# Altium schematic sheet Sensor.SchDoc: NH Speaker Sensor 16CH 2.3_C
size A2; Revision: 2.3; SheetNumber: 4; SheetTotal: 6
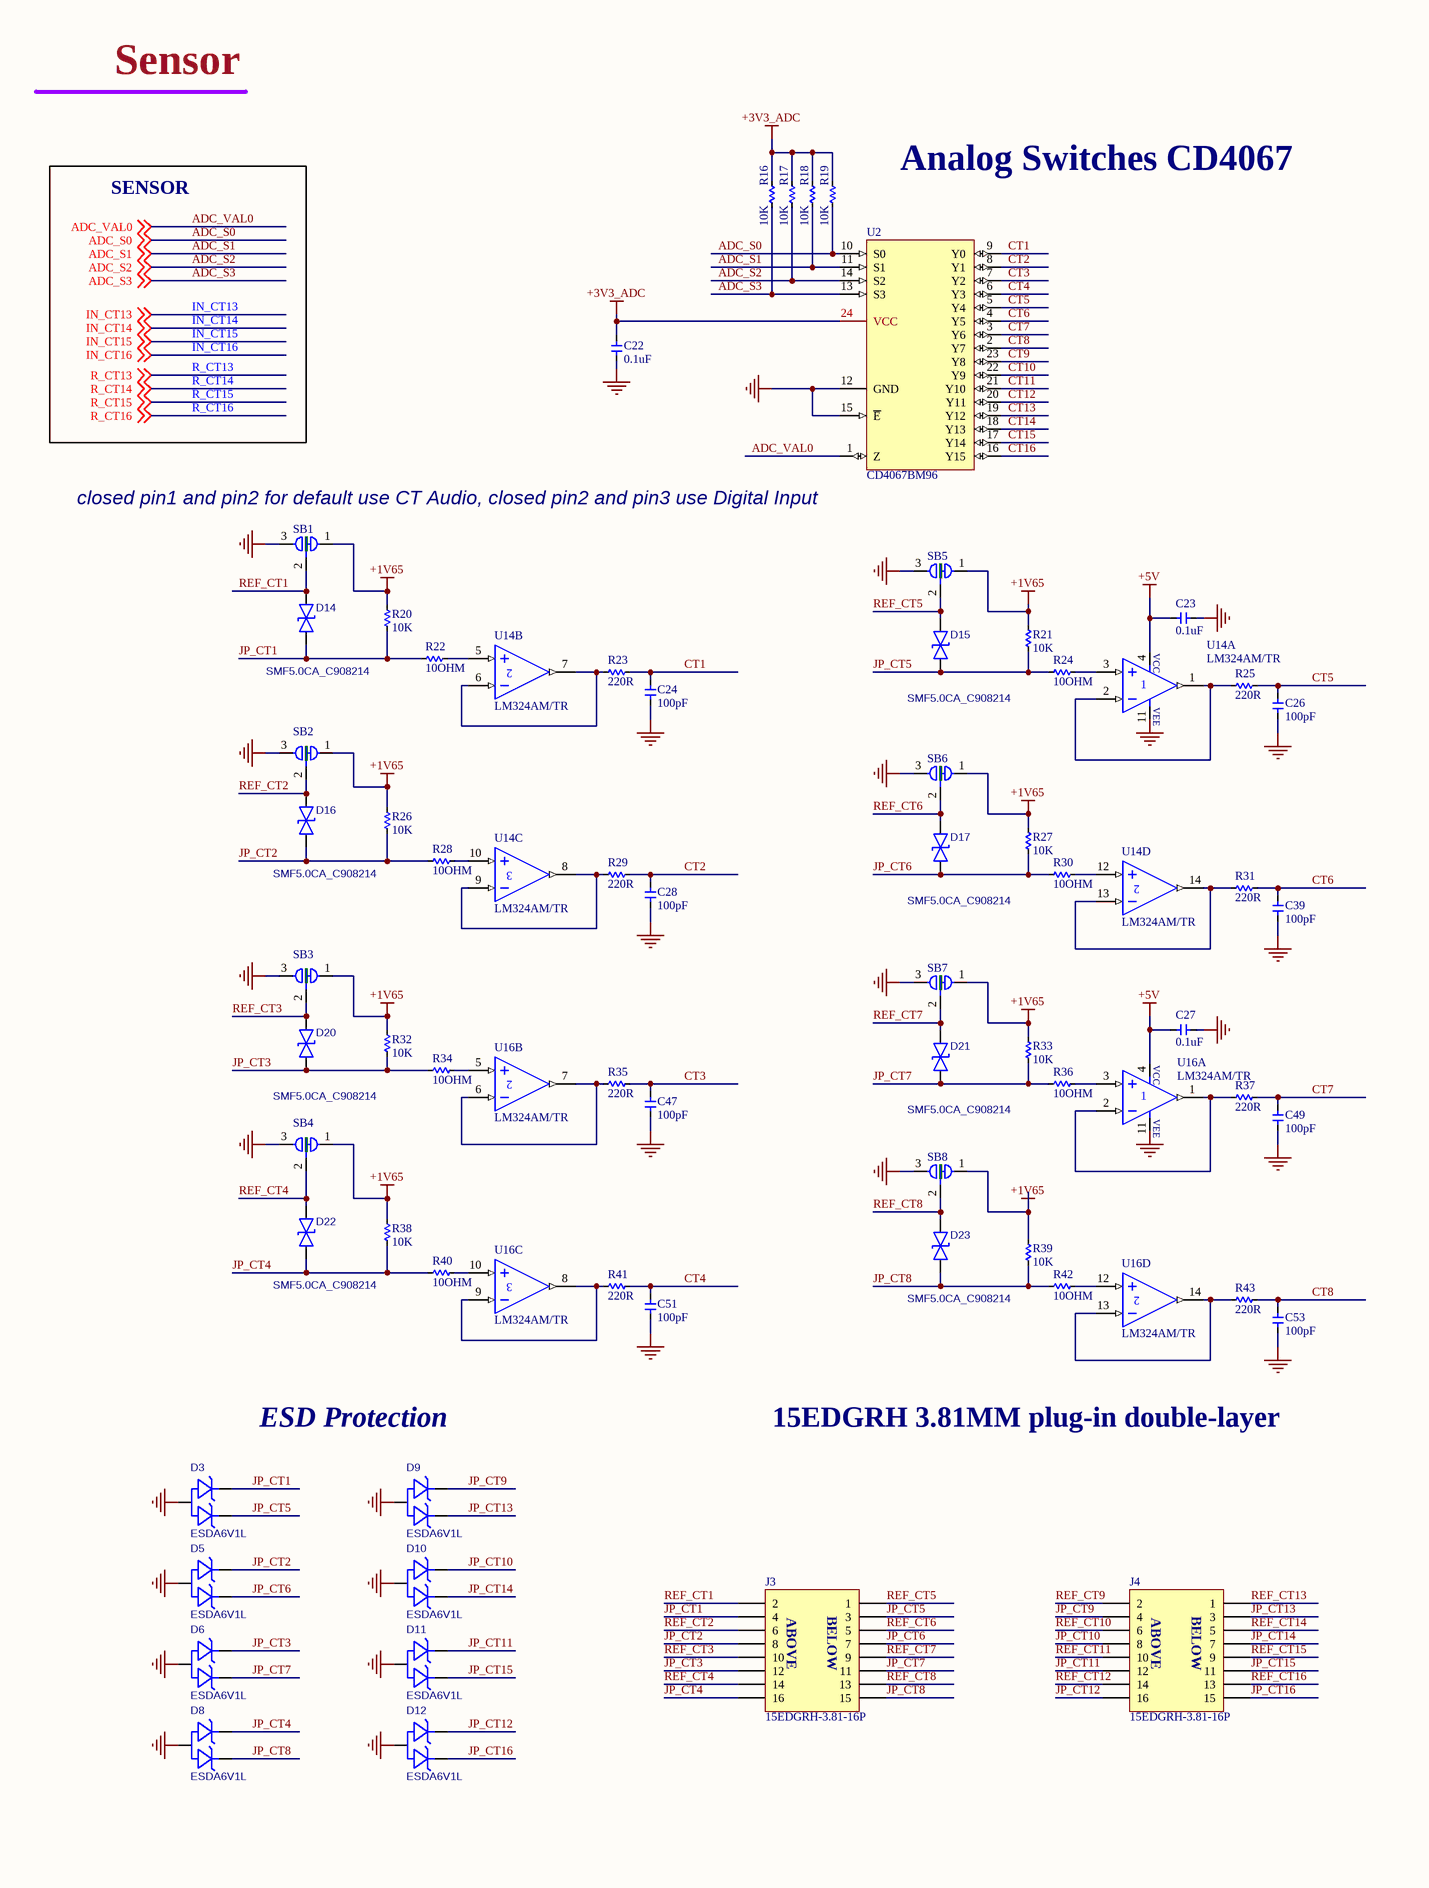
[diagram p0: Sensor.SchDoc, left]
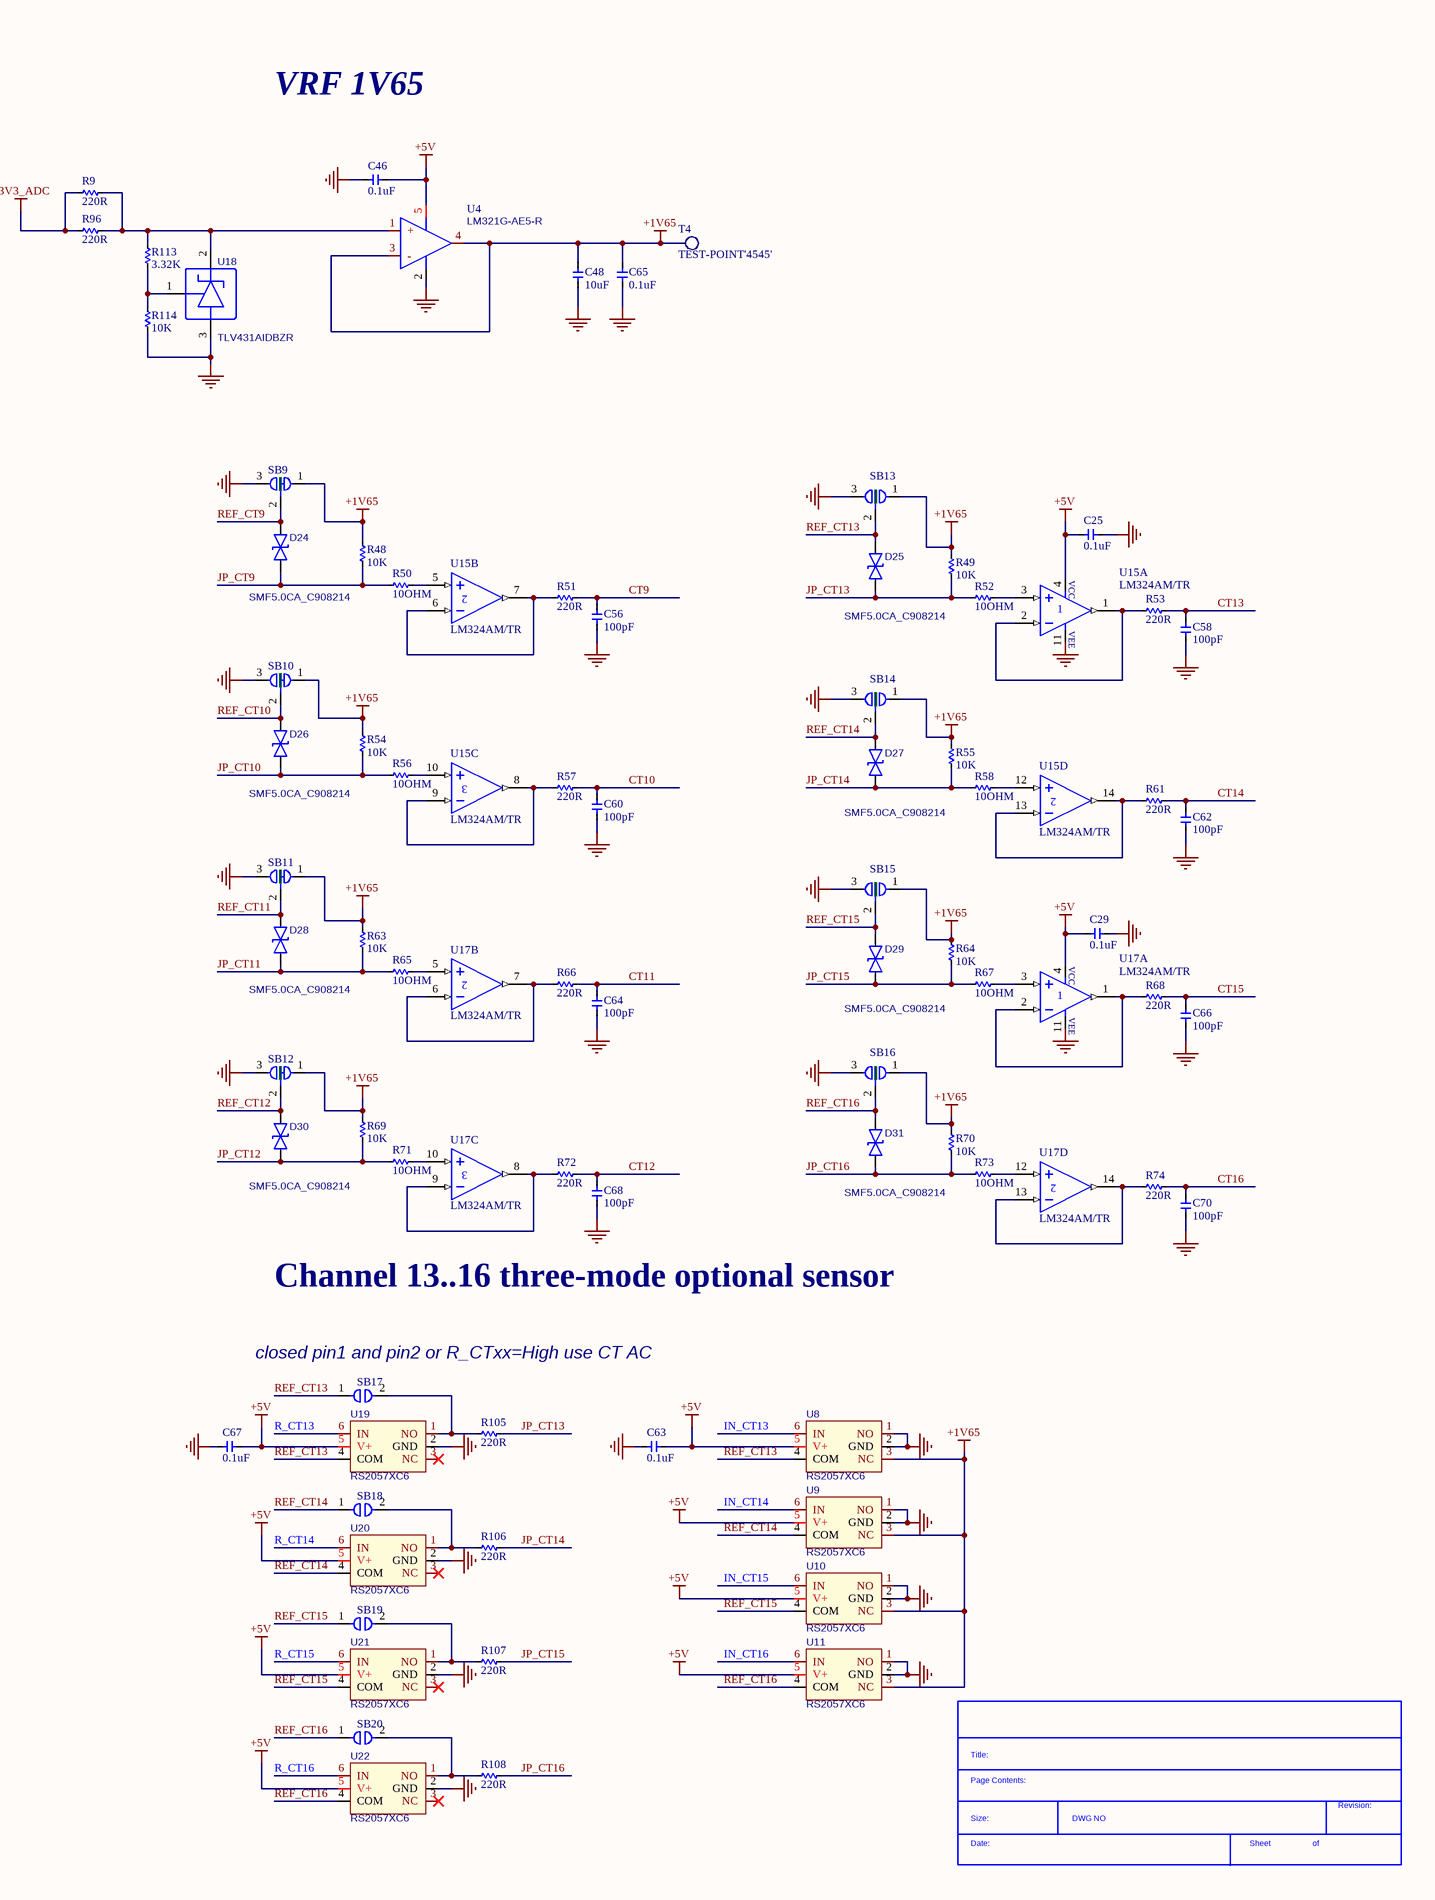
[diagram p1: Sensor.SchDoc, right]

## Parts
*?  SDTitleBlock  (value not drawn)  (graphical)
C22  0.1uF  [C_0603]
C23  0.1uF  [C_0603]
C24  100pF  [C_0603]
C25  0.1uF  [C_0603]
C26  100pF  [C_0603]
C27  0.1uF  [C_0603]
C28  100pF  [C_0603]
C29  0.1uF  [C_0603]
C39  100pF  [C_0603]
C46  0.1uF  [C_0603]
C47  100pF  [C_0603]
C48  10uF  [C_0603]
C49  100pF  [C_0603]
C51  100pF  [C_0603]
C53  100pF  [C_0603]
C56  100pF  [C_0603]
C58  100pF  [C_0603]
C60  100pF  [C_0603]
C62  100pF  [C_0603]
C63  0.1uF  [C_0603]
C64  100pF  [C_0603]
C65  0.1uF  [C_0603]
C66  100pF  [C_0603]
C67  0.1uF  [C_0603]
C68  100pF  [C_0603]
C70  100pF  [C_0603]
D3  ESDA6V1L  [SOT-23-3_L2.9-W1.3-P1.90-LS2.4-BR]
D5  ESDA6V1L  [SOT-23-3_L2.9-W1.3-P1.90-LS2.4-BR]
D6  ESDA6V1L  [SOT-23-3_L2.9-W1.3-P1.90-LS2.4-BR]
D8  ESDA6V1L  [SOT-23-3_L2.9-W1.3-P1.90-LS2.4-BR]
D9  ESDA6V1L  [SOT-23-3_L2.9-W1.3-P1.90-LS2.4-BR]
D10  ESDA6V1L  [SOT-23-3_L2.9-W1.3-P1.90-LS2.4-BR]
D11  ESDA6V1L  [SOT-23-3_L2.9-W1.3-P1.90-LS2.4-BR]
D12  ESDA6V1L  [SOT-23-3_L2.9-W1.3-P1.90-LS2.4-BR]
D14  SMF5.0CA_C908214  [SOD-123_L2.8-W1.8-LS3.7-BI]
D15  SMF5.0CA_C908214  [SOD-123_L2.8-W1.8-LS3.7-BI]
D16  SMF5.0CA_C908214  [SOD-123_L2.8-W1.8-LS3.7-BI]
D17  SMF5.0CA_C908214  [SOD-123_L2.8-W1.8-LS3.7-BI]
D20  SMF5.0CA_C908214  [SOD-123_L2.8-W1.8-LS3.7-BI]
D21  SMF5.0CA_C908214  [SOD-123_L2.8-W1.8-LS3.7-BI]
D22  SMF5.0CA_C908214  [SOD-123_L2.8-W1.8-LS3.7-BI]
D23  SMF5.0CA_C908214  [SOD-123_L2.8-W1.8-LS3.7-BI]
D24  SMF5.0CA_C908214  [SOD-123_L2.8-W1.8-LS3.7-BI]
D25  SMF5.0CA_C908214  [SOD-123_L2.8-W1.8-LS3.7-BI]
D26  SMF5.0CA_C908214  [SOD-123_L2.8-W1.8-LS3.7-BI]
D27  SMF5.0CA_C908214  [SOD-123_L2.8-W1.8-LS3.7-BI]
D28  SMF5.0CA_C908214  [SOD-123_L2.8-W1.8-LS3.7-BI]
D29  SMF5.0CA_C908214  [SOD-123_L2.8-W1.8-LS3.7-BI]
D30  SMF5.0CA_C908214  [SOD-123_L2.8-W1.8-LS3.7-BI]
D31  SMF5.0CA_C908214  [SOD-123_L2.8-W1.8-LS3.7-BI]
J3  15EDGRH-3.81-16P  [Header 3.81 8 pin dual row]
J4  15EDGRH-3.81-16P  [Header 3.81 8 pin dual row]
R9  220R  [R_0603]
R16  10K  [R_0603]
R17  10K  [R_0603]
R18  10K  [R_0603]
R19  10K  [R_0603]
R20  10K  [R_0603]
R21  10K  [R_0603]
R22  10OHM  [R_0603]
R23  220R  [R_0603]
R24  10OHM  [R_0603]
R25  220R  [R_0603]
R26  10K  [R_0603]
R27  10K  [R_0603]
R28  10OHM  [R_0603]
R29  220R  [R_0603]
R30  10OHM  [R_0603]
R31  220R  [R_0603]
R32  10K  [R_0603]
R33  10K  [R_0603]
R34  10OHM  [R_0603]
R35  220R  [R_0603]
R36  10OHM  [R_0603]
R37  220R  [R_0603]
R38  10K  [R_0603]
R39  10K  [R_0603]
R40  10OHM  [R_0603]
R41  220R  [R_0603]
R42  10OHM  [R_0603]
R43  220R  [R_0603]
R48  10K  [R_0603]
R49  10K  [R_0603]
R50  10OHM  [R_0603]
R51  220R  [R_0603]
R52  10OHM  [R_0603]
R53  220R  [R_0603]
R54  10K  [R_0603]
R55  10K  [R_0603]
R56  10OHM  [R_0603]
R57  220R  [R_0603]
R58  10OHM  [R_0603]
R61  220R  [R_0603]
R63  10K  [R_0603]
R64  10K  [R_0603]
R65  10OHM  [R_0603]
R66  220R  [R_0603]
R67  10OHM  [R_0603]
R68  220R  [R_0603]
R69  10K  [R_0603]
R70  10K  [R_0603]
R71  10OHM  [R_0603]
R72  220R  [R_0603]
R73  10OHM  [R_0603]
R74  220R  [R_0603]
R96  220R  [R_0603]
R105  220R  [R_0603]
R106  220R  [R_0603]
R107  220R  [R_0603]
R108  220R  [R_0603]
R113  3.32K  [R_0603]
R114  10K  [R_0603]
SB1  SOLDERJUMPER_2WAY  [SOLDERJUMPER_2WAY]  (value not drawn)  (no BOM)
SB2  SOLDERJUMPER_2WAY  [SOLDERJUMPER_2WAY]  (value not drawn)  (no BOM)
SB3  SOLDERJUMPER_2WAY  [SOLDERJUMPER_2WAY]  (value not drawn)  (no BOM)
SB4  SOLDERJUMPER_2WAY  [SOLDERJUMPER_2WAY]  (value not drawn)  (no BOM)
SB5  SOLDERJUMPER_2WAY  [SOLDERJUMPER_2WAY]  (value not drawn)  (no BOM)
SB6  SOLDERJUMPER_2WAY  [SOLDERJUMPER_2WAY]  (value not drawn)  (no BOM)
SB7  SOLDERJUMPER_2WAY  [SOLDERJUMPER_2WAY]  (value not drawn)  (no BOM)
SB8  SOLDERJUMPER_2WAY  [SOLDERJUMPER_2WAY]  (value not drawn)  (no BOM)
SB9  SOLDERJUMPER_2WAY  [SOLDERJUMPER_2WAY]  (value not drawn)  (no BOM)
SB10  SOLDERJUMPER_2WAY  [SOLDERJUMPER_2WAY]  (value not drawn)  (no BOM)
SB11  SOLDERJUMPER_2WAY  [SOLDERJUMPER_2WAY]  (value not drawn)  (no BOM)
SB12  SOLDERJUMPER_2WAY  [SOLDERJUMPER_2WAY]  (value not drawn)  (no BOM)
SB13  SOLDERJUMPER_2WAY_No JP  [SOLDERJUMPER_2WAY - No JP]  (value not drawn)  (no BOM)
SB14  SOLDERJUMPER_2WAY_No JP  [SOLDERJUMPER_2WAY - No JP]  (value not drawn)  (no BOM)
SB15  SOLDERJUMPER_2WAY_No JP  [SOLDERJUMPER_2WAY - No JP]  (value not drawn)  (no BOM)
SB16  SOLDERJUMPER_2WAY_No JP  [SOLDERJUMPER_2WAY - No JP]  (value not drawn)  (no BOM)
SB17  SOLDERJUMPER_1WAY  [SOLDERJUMPER_1WAY]  (value not drawn)  (no BOM)
SB18  SOLDERJUMPER_1WAY  [SOLDERJUMPER_1WAY]  (value not drawn)  (no BOM)
SB19  SOLDERJUMPER_1WAY  [SOLDERJUMPER_1WAY]  (value not drawn)  (no BOM)
SB20  SOLDERJUMPER_1WAY  [SOLDERJUMPER_1WAY]  (value not drawn)  (no BOM)
T4  TEST-POINT'4545'  [TP-D45MIL]  (no BOM)
U2  CD4067BM96  [SOIC-24_L15.4-W7.5-P1.27-LS10.3-BL]
U4  LM321G-AE5-R  [SOT-23-5_L3.0-W1.7-P0.95-LS2.8-BR]
U8  RS2057XC6  [SC-70-6_L2.2-W1.3-P0.65-LS2.2-BL]
U9  RS2057XC6  [SC-70-6_L2.2-W1.3-P0.65-LS2.2-BL]
U10  RS2057XC6  [SC-70-6_L2.2-W1.3-P0.65-LS2.2-BL]
U11  RS2057XC6  [SC-70-6_L2.2-W1.3-P0.65-LS2.2-BL]
U14  LM324AM/TR  [SOIC-14_3.9x8.7x1.27P]  (parts A,B,C,D of 4)
U15  LM324AM/TR  [SOIC-14_3.9x8.7x1.27P]  (parts A,B,C,D of 4)
U16  LM324AM/TR  [SOIC-14_3.9x8.7x1.27P]  (parts A,B,C,D of 4)
U17  LM324AM/TR  [SOIC-14_3.9x8.7x1.27P]  (parts A,B,C,D of 4)
U18  TLV431AIDBZR  [SOT-23-3_L2.9-W1.3-P1.90-LS2.4-BR]
U19  RS2057XC6  [SC-70-6_L2.2-W1.3-P0.65-LS2.2-BL]
U20  RS2057XC6  [SC-70-6_L2.2-W1.3-P0.65-LS2.2-BL]
U21  RS2057XC6  [SC-70-6_L2.2-W1.3-P0.65-LS2.2-BL]
U22  RS2057XC6  [SC-70-6_L2.2-W1.3-P0.65-LS2.2-BL]

## Nets
+1V65: C48.2 C65.2 R20.1 R21.2 R26.2 R27.2 R32.1 R33.2 R38.2 R39.2 R48.2 R49.2 R54.2 R55.2 R63.2 R64.2 R69.2 R70.2 SB1.1 SB2.1 SB3.1 SB4.1 SB5.1 SB6.1 SB7.1 SB8.1 SB9.1 SB10.1 SB11.1 SB12.1 SB13.1 SB14.1 SB15.1 SB16.1 T4.T U4.3(-) U4.4(OUT) U8.3(NC) U9.3(NC) U10.3(NC) U11.3(NC)
+3V3_ADC: C22.2 R9.1 R16.2 R17.2 R18.2 R19.2 R96.1 U2.24(VCC)
+5V: C23.2 C25.2 C27.2 C29.2 C46.2 C63.1 C67.1 U4.5(VCC+) U8.5(V+) U9.5(V+) U10.5(V+) U11.5(V+) U14.4(V+) U15.4(V+) U16.4(V+) U17.4(V+) U19.5(V+) U20.5(V+) U21.5(V+) U22.5(V+)
GND: C22.1 C23.1 C24.1 C25.1 C26.1 C27.1 C28.1 C29.1 C39.1 C46.1 C47.1 C48.1 C49.1 C51.1 C53.1 C56.1 C58.1 C60.1 C62.1 C63.2 C64.1 C65.1 C66.1 C67.2 C68.1 C70.1 D3.3(A) D5.3(A) D6.3(A) D8.3(A) D9.3(A) D10.3(A) D11.3(A) D12.3(A) R114.2 SB1.3 SB2.3 SB3.3 SB4.3 SB5.3 SB6.3 SB7.3 SB8.3 SB9.3 SB10.3 SB11.3 SB12.3 SB13.3 SB14.3 SB15.3 SB16.3 U2.12(GND) U2.15(~{E}) U4.2(GND) U8.1(NO) U8.2(GND) U9.1(NO) U9.2(GND) U10.1(NO) U10.2(GND) U11.1(NO) U11.2(GND) U14.11(V-) U15.11(V-) U16.11(V-) U17.11(V-) U18.3(A) U19.2(GND) U20.2(GND) U21.2(GND) U22.2(GND)
ADC_S0: R19.1 U2.10(S0) ; off-sheet ADC_S0
ADC_S1: R18.1 U2.11(S1) ; off-sheet ADC_S1
ADC_S2: R17.1 U2.14(S2) ; off-sheet ADC_S2
ADC_S3: R16.1 U2.13(S3) ; off-sheet ADC_S3
ADC_VAL0: U2.1(Z) ; off-sheet ADC_VAL0
CT1: C24.2 R23.2 U2.9(Y0)
CT2: C28.2 R29.2 U2.8(Y1)
CT3: C47.2 R35.2 U2.7(Y2)
CT4: C51.2 R41.2 U2.6(Y3)
CT5: C26.2 R25.2 U2.5(Y4)
CT6: C39.2 R31.2 U2.4(Y5)
CT7: C49.2 R37.2 U2.3(Y6)
CT8: C53.2 R43.2 U2.2(Y7)
CT9: C56.2 R51.2 U2.23(Y8)
CT10: C60.2 R57.2 U2.22(Y9)
CT11: C64.2 R66.2 U2.21(Y10)
CT12: C68.2 R72.2 U2.20(Y11)
CT13: C58.2 R53.2 U2.19(Y12)
CT14: C62.2 R61.2 U2.18(Y13)
CT15: C66.2 R68.2 U2.17(Y14)
CT16: C70.2 R74.2 U2.16(Y15)
IN_CT13: U8.6(IN) ; off-sheet IN_CT13
IN_CT14: U9.6(IN) ; off-sheet IN_CT14
IN_CT15: U10.6(IN) ; off-sheet IN_CT15
IN_CT16: U11.6(IN) ; off-sheet IN_CT16
JP_CT1: D3.2(C) D14.2 J3.4 R20.2 R22.2
JP_CT2: D5.2(C) D16.2 J3.8 R26.1 R28.2
JP_CT3: D6.2(C) D20.2 J3.12 R32.2 R34.2
JP_CT4: D8.2(C) D22.2 J3.16 R38.1 R40.2
JP_CT5: D3.1(C) D15.2 J3.3 R21.1 R24.2
JP_CT6: D5.1(C) D17.2 J3.7 R27.1 R30.2
JP_CT7: D6.1(C) D21.2 J3.11 R33.1 R36.2
JP_CT8: D8.1(C) D23.2 J3.15 R39.1 R42.2
JP_CT9: D9.2(C) D24.2 J4.4 R48.1 R50.2
JP_CT10: D10.2(C) D26.2 J4.8 R54.1 R56.2
JP_CT11: D11.2(C) D28.2 J4.12 R63.1 R65.2
JP_CT12: D12.2(C) D30.2 J4.16 R69.1 R71.2
JP_CT13: D9.1(C) D25.2 J4.3 R49.1 R52.2 R105.1
JP_CT14: D10.1(C) D27.2 J4.7 R55.1 R58.2 R106.1
JP_CT15: D11.1(C) D29.2 J4.11 R64.1 R67.2 R107.1
JP_CT16: D12.1(C) D31.2 J4.15 R70.1 R73.2 R108.1
R_CT13: U19.6(IN) ; off-sheet R_CT13
R_CT14: U20.6(IN) ; off-sheet R_CT14
R_CT15: U21.6(IN) ; off-sheet R_CT15
R_CT16: U22.6(IN) ; off-sheet R_CT16
REF_CT1: D14.1 J3.2 SB1.2
REF_CT2: D16.1 J3.6 SB2.2
REF_CT3: D20.1 J3.10 SB3.2
REF_CT4: D22.1 J3.14 SB4.2
REF_CT5: D15.1 J3.1 SB5.2
REF_CT6: D17.1 J3.5 SB6.2
REF_CT7: D21.1 J3.9 SB7.2
REF_CT8: D23.1 J3.13 SB8.2
REF_CT9: D24.1 J4.2 SB9.2
REF_CT10: D26.1 J4.6 SB10.2
REF_CT11: D28.1 J4.10 SB11.2
REF_CT12: D30.1 J4.14 SB12.2
REF_CT13: D25.1 J4.1 SB13.2 SB17.1 U8.4(COM) U19.4(COM)
REF_CT14: D27.1 J4.5 SB14.2 SB18.1 U9.4(COM) U20.4(COM)
REF_CT15: D29.1 J4.9 SB15.2 SB19.1 U10.4(COM) U21.4(COM)
REF_CT16: D31.1 J4.13 SB16.2 SB20.1 U11.4(COM) U22.4(COM)
NetR9_2: R9.2 R96.2 R113.1 U4.1(+) U18.2(C)
NetR22_1: R22.1 U14.5(IN+)
NetR23_1: R23.1 U14.6(IN-) U14.7(OUT)
NetR24_1: R24.1 U14.3(IN+)
NetR25_1: R25.1 U14.1(OUT) U14.2(IN-)
NetR28_1: R28.1 U14.10(IN+)
NetR29_1: R29.1 U14.8(OUT) U14.9(IN-)
NetR30_1: R30.1 U14.12(IN+)
NetR31_1: R31.1 U14.13(IN-) U14.14(OUT)
NetR34_1: R34.1 U16.5(IN+)
NetR35_1: R35.1 U16.6(IN-) U16.7(OUT)
NetR36_1: R36.1 U16.3(IN+)
NetR37_1: R37.1 U16.1(OUT) U16.2(IN-)
NetR40_1: R40.1 U16.10(IN+)
NetR41_1: R41.1 U16.8(OUT) U16.9(IN-)
NetR42_1: R42.1 U16.12(IN+)
NetR43_1: R43.1 U16.13(IN-) U16.14(OUT)
NetR50_1: R50.1 U15.5(IN+)
NetR51_1: R51.1 U15.6(IN-) U15.7(OUT)
NetR52_1: R52.1 U15.3(IN+)
NetR53_1: R53.1 U15.1(OUT) U15.2(IN-)
NetR56_1: R56.1 U15.10(IN+)
NetR57_1: R57.1 U15.8(OUT) U15.9(IN-)
NetR58_1: R58.1 U15.12(IN+)
NetR61_1: R61.1 U15.13(IN-) U15.14(OUT)
NetR65_1: R65.1 U17.5(IN+)
NetR66_1: R66.1 U17.6(IN-) U17.7(OUT)
NetR67_1: R67.1 U17.3(IN+)
NetR68_1: R68.1 U17.1(OUT) U17.2(IN-)
NetR71_1: R71.1 U17.10(IN+)
NetR72_1: R72.1 U17.8(OUT) U17.9(IN-)
NetR73_1: R73.1 U17.12(IN+)
NetR74_1: R74.1 U17.13(IN-) U17.14(OUT)
NetR105_2: R105.2 SB17.2 U19.1(NO)
NetR106_2: R106.2 SB18.2 U20.1(NO)
NetR107_2: R107.2 SB19.2 U21.1(NO)
NetR108_2: R108.2 SB20.2 U22.1(NO)
NetR113_2: R113.2 R114.1 U18.1(REF)

Not connected (* = marked no-connect by the designer): U19 3(NC)*; U20 3(NC)*; U21 3(NC)*; U22 3(NC)*

## Notes on the sheet
- Sensor
- SENSOR
- Analog Switches CD4067
- VRF 1V65
- closed pin1 and pin2 for default use CT Audio, closed pin2 and pin3 use Digital Input
- ESD Protection
- 15EDGRH 3.81MM plug-in double-layer
- Channel 13..16 three-mode optional sensor
- (near SB17) closed pin1 and pin2 or R_CTxx=High use CT AC
- (in symbol 15EDGRH-3.81-2x8P) ABOVE; BELOW
- (in symbol LM324AM/TR, part A) VCC; VEE
- (in symbol SDTitleBlock) Title:; Page Contents:; Revision:; Size:; DWG NO; Date:; Sheet; of

## Library data of the parts
*? = SDTitleBlock: TitleBlock
C22 C23 C25 C27 C29 C46 C63 C65 C67 = CC0603KRX7R9BB104: 100NF 50V 0603 ROHS; Manufacturer: YAGEO; Manufacturer Part Number: CC0603KRX7R9BB104; Package: 0603; LCSC Part Number: C14663; ComponentLink1Description: Digikey Link; ComponentLink1URL: https://www.digikey.com/en/products/detail/yageo/CC0603KRX7R9BB104/2103082?s=N4IgTCBcDaIMwEYEFoFwCzuWZA5AIiALoC%2BQA; ComponentLink2Description: LCSC Link; ComponentLink2URL: https://jlcpcb.com/parts/componentSearch?searchTxt=10k%200603; Assembly type: SMT Assembly
C24 C26 C28 C39 C47 C49 C51 C53 C56 C58 C60 C62 C64 C66 C68 C70 = 0603CG101J500NT: 100pF 50V C0G ±5% 0603 Multilayer Ceramic Capacitors MLCC - SMD/SMT ROHS; Manufacturer: FH(Guangdong Fenghua Advanced Tech); Manufacturer Part Number: 0603CG101J500NT; Package: 0603; LCSC Part Number: C1635; ComponentLink1Description: Digikey Link; ComponentLink2Description: LCSC Link; Assembly Type: SMT Assembly
C48 = CL10A106KP8NNNC: 10uF 10V 0603 Multilayer Ceramic Capacitors MLCC - SMD/SMT ROHS; Manufacturer: Samsung Electro-Mechanics; Manufacturer Part Number: CL10A106KP8NNNC; Package: 0603; LCSC Part Number: C19702; ComponentLink1Description: Digikey Link; ComponentLink1URL: https://www.digikey.com/en/products/detail/samsung-electro-mechanics/CL10A105KB8NNNC/3887518?s=N4IgTCBcDaIMIBkCMAGAgqgrAaQEIA4A5YuEAXQF8g; ComponentLink2Description: LCSC Link; ComponentLink2URL: https://jlcpcb.com/parts/componentSearch?searchTxt=10k%200603; Assembly Type: SMT Assembly
D3 D5 D6 D8-D12 = ESDA6V1L_C587141: ESDA6V1L SOT-23-3  ESD Protection Devices ROHS; Manufacturer: TECH PUBLIC(台舟); LCSC Part Number: C587141; Manufacturer Part Number: ESDA6V1L; Package: SOT-23-3; Assembly Type: SMT Assembly
D14-D17 D20-D31 = SMF5.0CA_C908214: SMF5.0CA 9.2V 6.4V 5V SOD-123  TVS ROHS; Manufacturer: FUXINSEMI(富芯森美); LCSC Part Number: C908214; Manufacturer Part Number: SMF5.0CA; Package: SOD-123; Assembly Type: SMT Assembly
J3 J4 = 15EDGRH-3.81-2x8P: 16 Position Terminal Block Header, Male Pins, Shrouded (16 Side) 0.150" (3.81mm) 90°, Right Angle  Through Hole; Manufacturer: Phoenix Contact; Manufacturer Part Number: 1843130; Package: Through Hole; ComponentLink1URL: https://datasheet.ciiva.com/15197/getdatasheetpartid-704204-15197555.pdf?src-supplier=Verical; ComponentLink1Description: https://datasheet.ciiva.com/15197/getdatasheetpartid-704204-15197555.pdf?src-supplier=Verical; ComponentLink2URL: https://datasheet.ciiva.com/6762/1843088-6762520.pdf?src-supplier=Digi-Key; ComponentLink2Description: https://datasheet.ciiva.com/6762/1843088-6762520.pdf?src-supplier=Digi-Key; ComponentLink3URL: https://datasheet.ciiva.com/16097/1843088-16097099.pdf?src-supplier=Onlinecomponents.com; ComponentLink3Description: https://datasheet.ciiva.com/16097/1843088-16097099.pdf?src-supplier=Onlinecomponents.com; ComponentLink4URL: https://datasheet.ciiva.com/26339/772185-da-01-de-grundgehaeuse-1843088-50-st-26339092.pdf?src-supplier=Conrad; ComponentLink4Description: https://datasheet.ciiva.com/26339/772185-da-01-de-grundgehaeuse-1843088-50-st-26339092.pdf?src-supplier=Conrad; LCSC Part Number: N/A; Assembly Type: Hand Soldering
R9 R23 R25 R29 R31 R35 R37 R41 R43 R51 R53 R57 R61 R66 R68 R72 R74 R96 R105-R108 = 0603WAF2200T5E: 220R 22OHMS ±1% 1/10W 0603 ROHS; Manufacturer: Uniroyal Elec; Manufacturer Part Number: 0603WAF2200T5E; LCSC Part Number: C22962; Package: 0603; Assembly Type: SMT Assembly
R16-R21 R26 R27 R32 R33 R38 R39 R48 R49 R54 R55 R63 R64 R69 R70 R114 = 0603WAF1002T5E: 10KOHMS ±1% 1/10W 0603 ROHS; Manufacturer: Uniroyal Elec; Manufacturer Part Number: 0603WAF1002T5E; LCSC Part Number: C25804; Package: 0603; Assembly Type: SMT Assembly
R22 R24 R28 R30 R34 R36 R40 R42 R50 R52 R56 R58 R65 R67 R71 R73 = 0603WAF100JT5E: 10OHMS ±1% 1/10W 0603 ROHS; Manufacturer: Uniroyal Elec; Manufacturer Part Number: 0603WAF100JT5E; LCSC Part Number: C22859; Package: 0603; Assembly Type: SMT Assembly
R113 = RC0603FR-073K32L: 3.32K  ±1% 1/10W 0603 ROHS; Manufacturer: Uniroyal Elec; Manufacturer Part Number: RC0603FR-073K32L; LCSC Part Number: C137731; Package: 0603; Assembly Type: SMT Assembly
SB1-SB12 = SOLDERJUMPER_2WAY: 2-Way Solder Jumper; GateName_1: G$1; SymbolName_1: SOLDERJUMPER_2WAY; LibraryName: microbuilder; DeviceSetName: SOLDERJUMPER_2WAY
SB13-SB16 = SOLDERJUMPER_2WAY_No JP: GateName_1: G$1; SymbolName_1: SOLDERJUMPER_2WAY_No JP; LibraryName: microbuilder; DeviceSetName: SOLDERJUMPER_2WAY_No JP
SB17-SB20 = SOLDERJUMPER_1WAY: GateName_1: G$1; SymbolName_1: SOLDERJUMPER_1WAY; LibraryName: microbuilder; DeviceSetName: SOLDERJUMPER_1WAY
T4 = TEST-POINT'4545': Manufacturer: No; Manufacturer Part Number: No; LCSC Part Number: No; Package: No
U2 = CD4067BM96: CD4067BM96 1 240Ω SOP-24-300mil  Analog Switches / Multiplexers ROHS; Manufacturer: Texas Instruments; Manufacturer Part Number: CD4067BM96; Package: SOIC-24-300mil; LCSC Part Number: C6525; Assembly Type: SMT Assembly
U4 = LM321G-AE5-R: 1MHz 1 General Purpose - 0.4 V/us 3V ~ 32V SOT-23-5 General Purpose Amplifiers ROHS; Manufacturer: UTC; Manufacturer Part Number: LM321G-AE5-R; LCSC Part Number: C100068; Package: SOT-23-5; Assembly Type: SMT Assembly
U8-U11 U19-U22 = RS2057XC6: 8Ω 1 SPDT(SPDT) SC-70-6  Analog Switches / Multiplexers ROHS; Manufacturer: RUNIC(润石); LCSC Part Number: C237027; Manufacturing Part Number: RS2057XC6; Package: SC-70-6; Assembly Type: C237027
U14-U17 = LM324AM/TR: LM324AM/NOPB GENERAL PURPOSE AMPLIFIERS SOIC-14 ROHS; Manufacturer: HGSEMI; Manufacturer Part Number: LM324AM/TR; Package: SOIC-14_3.9x8.7x1.27P; LCSC Part Number: C2688471; Assembly Type: SMT Assembly
U18 = TLV431AIDBZR: TLV431AIDBZR 1.24V~6V ±1% 15mA Adjustable SOT-23  Voltage References ROHS; Manufacturer: Texas Instruments; Manufacturer Part Number: TLV431AIDBZR; LCSC Part Number: C56765; Packge: SOT-23; Assembly Type: SMT Assembly